# Altium project Battery_Backpower.PrjPcb
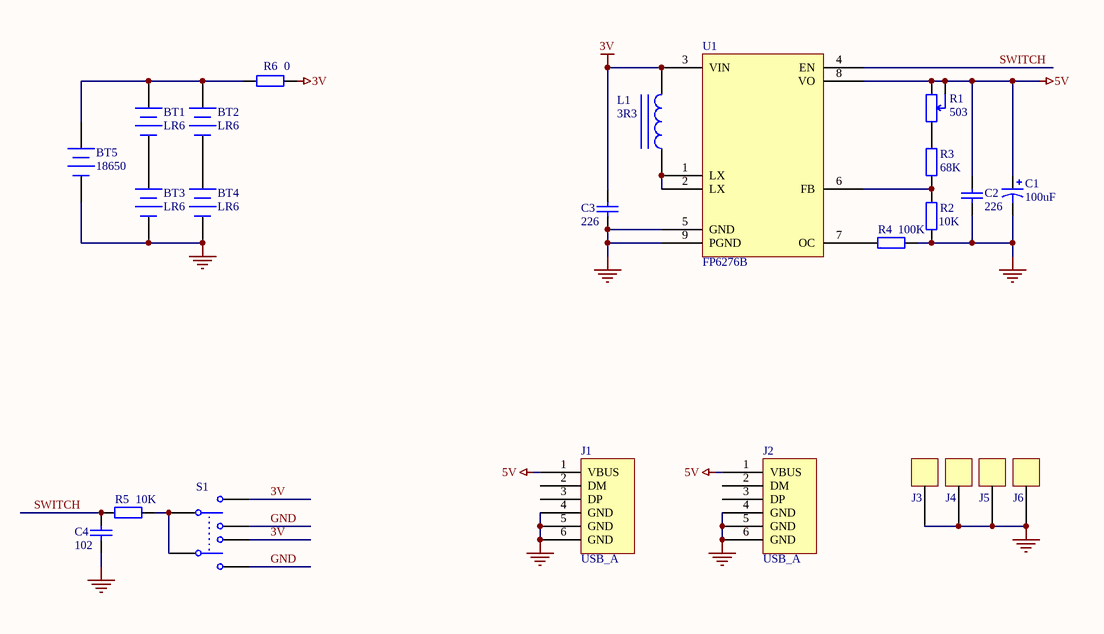
[diagram p0: backpower_main.SchDoc]
1 sheet, 24 parts. Net scope: global (net labels, ports and power ports of the same name join across sheets).
Board file: backpower_main.PcbDoc

## Sheet backpower_main.SchDoc
size A4

### Parts
BT1  LR6  [BAT-LR6]
BT2  LR6  [BAT-LR6]
BT3  LR6  [BAT-LR6]
BT4  LR6  [BAT-LR6]
BT5  18650  [BAT-18650]
C1  100uF  [CAP D6.3]
C2  226  [C5mm]
C3  226  [C5mm]
C4  102  [C5mm]
J1  USB_A  [USB-A dip]
J2  USB_A  [USB-A dip]
J3  Hole  [PADR3/4]  (value not drawn)
J4  Hole  [PADR3/4]  (value not drawn)
J5  Hole  [PADR3/4]  (value not drawn)
J6  Hole  [PADR3/4]  (value not drawn)
L1  3R3  [CKPK0912]
R1  503  [VZ067]
R2  10K  [R1/4W]
R3  68K  [R1/4W]
R4  100K  [R1/4W]
R5  10K  [R1/4W]
R6  0  [R0603]
S1  SW-DPDT  [SW-8*8]  (value not drawn)
U1  FP6276B  [SOP8L_EP]

### Nets
3V: C3.2 L1.2 R6.2 S1.2 S1.5 U1.3(VIN)
5V: C1.1 C2.1 J1.1(VBUS) J2.1(VBUS) R1.1 R1.2 U1.8(VO)
GND: BT3.2(-) BT4.2(-) BT5.2(-) C1.2 C2.2 C3.1 C4.1 J1.4(GND) J1.5(GND) J1.6(GND) J2.4(GND) J2.5(GND) J2.6(GND) J3.1 J4.1 J5.1 J6.1 R2.2 R4.1 S1.3 S1.6 U1.5(GND) U1.9(PGND)
SWITCH: C4.2 R5.1 U1.4(EN)
NetBT1_1: BT1.1(+) BT2.1(+) BT5.1(+) R6.1
NetBT1_2: BT1.2(-) BT3.1(+)
NetBT2_2: BT2.2(-) BT4.1(+)
NetL1_1: L1.1 U1.1(LX) U1.2(LX)
NetR1_3: R1.3 R3.1
NetR2_1: R2.1 R3.2 U1.6(FB)
NetR4_2: R4.2 U1.7(OC)
NetR5_2: R5.2 S1.1 S1.4

Not connected (* = marked no-connect by the designer): J1 2(DM) 3(DP); J2 2(DM) 3(DP)

### Library data of the parts
BT1-BT5 = Battery: Multicell Battery; Published: 24-Mar-1999; LatestRevisionDate: 17-Jul-2002; LatestRevisionNote: Re-released for DXP Platform.; PackageReference: BAT-2; Publisher: Altium Limited; PackageDescription: Battery; 2 Leads
C1 = Cap Pol1: Polarized Capacitor (Radial); Value: 100pF; Published: 8-Jun-2000; LatestRevisionDate: 17-Jul-2002; LatestRevisionNote: Re-released for DXP Platform.; PackageReference: RB7.6-15; Publisher: Altium Limited; PackageDescription: Polarized Capacitor (Radial); 2 Leads
C2-C4 = Cap: Capacitor; Value: 100pF; Published: 8-Jun-2000; LatestRevisionDate: 17-Jul-2002; LatestRevisionNote: Re-released for DXP Platform.; PackageReference: RAD-0.3; Publisher: Altium Limited; PackageDescription: Radial Cap, Thru-Hole; 2 Leads; 0.3 in Pin Spacing
L1 = Inductor Iron: Magnetic-Core Inductor; Value: 10mH; Published: 24-Mar-1999; LatestRevisionDate: 17-Jul-2002; LatestRevisionNote: Re-released for DXP Platform.; PackageReference: AXIAL-0.9; Publisher: Altium Limited; PackageDescription: Axial Device, Thru-Hole; 2 Leads; 0.9 in Pin Spacing
R1 = Res Adj1
R2-R6 = Res2: Resistor; Value: 1K; Published: 8-Jun-2000; LatestRevisionDate: 17-Jul-2002; LatestRevisionNote: Re-released for DXP Platform.; PackageReference: AXIAL-0.4; Publisher: Altium Limited; PackageDescription: Axial Device, Thru-Hole; 2 Leads; 0.4 in Pin Spacing
S1 = SW-DPDT: Double-Pole, Double-Throw Switch; Published: 24-Mar-1999; LatestRevisionDate: 17-Jul-2002; LatestRevisionNote: Re-released for DXP Platform.; PackageReference: DPDT-6; Publisher: Altium Limited; PackageDescription: Switch; 6 Leads